# Altium schematic sheet Sheet_1 copy copy copy_2022-03-16.schdoc
size 316 x 219 mm
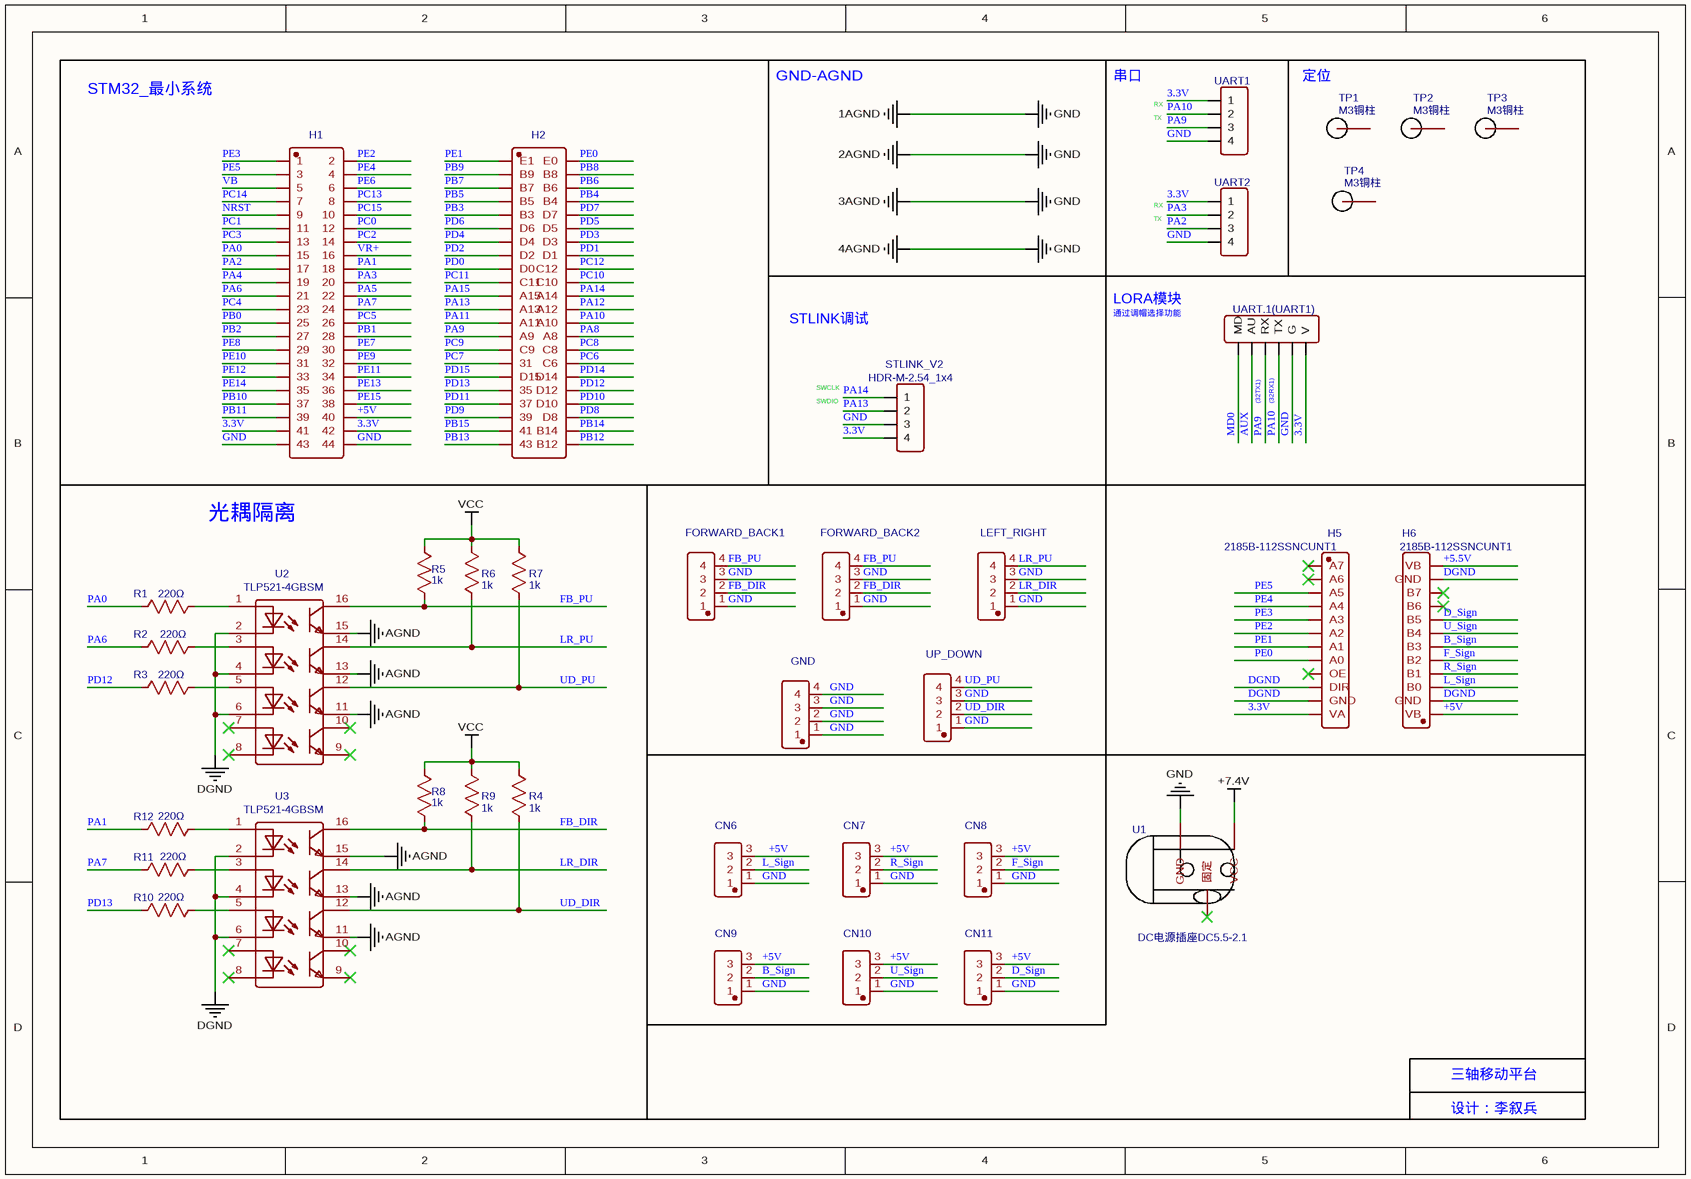
[diagram p0: Sheet_1 copy copy copy_2022-03-16.schdoc]

## Parts
CN6  15ETYRC-3.81-03P-14-00AH  [CONN-TH_15ETYRC-3.81-03P-14-00AH]  (value not drawn)
CN7  15ETYRC-3.81-03P-14-00AH  [CONN-TH_15ETYRC-3.81-03P-14-00AH]  (value not drawn)
CN8  15ETYRC-3.81-03P-14-00AH  [CONN-TH_15ETYRC-3.81-03P-14-00AH]  (value not drawn)
CN9  15ETYRC-3.81-03P-14-00AH  [CONN-TH_15ETYRC-3.81-03P-14-00AH]  (value not drawn)
CN10  15ETYRC-3.81-03P-14-00AH  [CONN-TH_15ETYRC-3.81-03P-14-00AH]  (value not drawn)
CN11  15ETYRC-3.81-03P-14-00AH  [CONN-TH_15ETYRC-3.81-03P-14-00AH]  (value not drawn)
FORWARD_BACK1  15ETYRC-3.81-04P-14-00AH  [CONN-TH_15ETYRC-3.81-04P-14-00AH]  (value not drawn)
FORWARD_BACK2  15ETYRC-3.81-04P-14-00AH  [CONN-TH_15ETYRC-3.81-04P-14-00AH]  (value not drawn)
GND  15ETYRC-3.81-04P-14-00AH  [CONN-TH_15ETYRC-3.81-04P-14-00AH]  (value not drawn)
H1  X5521FV-2X22C70D30-1000  [HDR-TH_44P-P2.54-V-F-R2-C22-S2.54]  (value not drawn)
H2  从5  [HDR-TH_44P-P2.54-V-F-R2-C22-S2.54]  (value not drawn)
H5  2185B-112SSNCUNT1  [HDR-TH_12P-P2.54-V-F]
H6  2185B-112SSNCUNT1  [HDR-TH_12P-P2.54-V-F]
LEFT_RIGHT  15ETYRC-3.81-04P-14-00AH  [CONN-TH_15ETYRC-3.81-04P-14-00AH]  (value not drawn)
R1  220Ω  [R0603]
R2  220Ω  [R0603]
R3  220Ω  [R0603]
R4  1k  [R0603]
R5  1k  [R0603]
R6  1k  [R0603]
R7  1k  [R0603]
R8  1k  [R0603]
R9  1k  [R0603]
R10  220Ω  [R0603]
R11  220Ω  [R0603]
R12  220Ω  [R0603]
STLINK_V2  HDR-M-2.54_1x4  [HDR-M-2.54_1X4]
TP1  M3铜柱  [M3铜柱]
TP2  M3铜柱  [M3铜柱]
TP3  M3铜柱  [M3铜柱]
TP4  M3铜柱  [M3铜柱]
U1  DC电源插座DC5.5-2.1  [DC电源插座5.5-2.1]
U2  TLP521-4GBSM  [OPTO-SMD-16_L20.0-W6.5-P2.54-LS10.2-BL]
U3  TLP521-4GBSM  [OPTO-SMD-16_L20.0-W6.5-P2.54-LS10.2-BL]
UART1  HDR-M-2.54_1x4  [HDR-M-2.54_1X4]  (value not drawn)
UART2  HDR-M-2.54_1x4  [HDR-M-2.54_1X4]  (value not drawn)
UART.1(UART1)  HDR-F-2.54_1x6  [HDR-F-2.54_1X6]  (value not drawn)
UP_DOWN  15ETYRC-3.81-04P-14-00AH  [CONN-TH_15ETYRC-3.81-04P-14-00AH]  (value not drawn)

## Nets
+7.4V: U1.1(VCC)
AGND: U2.11(EM) U2.13(EM) U2.15(EM) U3.11(EM) U3.13(EM) U3.15(EM)
DGND: H5.10(DIR) H5.11(GND) H6.2(GND) H6.11(GND) U2.2(CAT) U2.4(CAT) U2.6(CAT) U3.2(CAT) U3.4(CAT) U3.6(CAT)
GND: CN6.1 CN7.1 CN8.1 CN9.1 CN10.1 CN11.1 FORWARD_BACK1.1 FORWARD_BACK1.3 FORWARD_BACK2.1 FORWARD_BACK2.3 GND.1 GND.2 GND.3 GND.4 H1.43 H1.44 LEFT_RIGHT.1 LEFT_RIGHT.3 STLINK_V2.3 U1.2(GND) UART1.4 UART2.4 UART.1(UART1).5(G) UP_DOWN.1 UP_DOWN.3  [also labelled 1AGND, 2AGND, 3AGND, 4AGND]
VCC: R4.2 R5.2 R6.1 R7.2 R8.2 R9.1
3.3V: H1.41 H1.42 H5.12(VA) STLINK_V2.4 UART1.1 UART2.1 UART.1(UART1).6(V)
+5.5V: H6.12(VB)
+5V: CN6.3 CN7.3 CN8.3 CN9.3 CN10.3 CN11.3 H1.40 H6.1(VB)
AUX: UART.1(UART1).2(AU)
B_Sign: CN9.2 H6.6(B3)
D_Sign: CN11.2 H6.8(B5)
F_Sign: CN8.2 H6.5(B2)
FB_DIR: FORWARD_BACK1.2 FORWARD_BACK2.2 R8.1 U3.16(COL)
FB_PU: FORWARD_BACK1.4 FORWARD_BACK2.4 R5.1 U2.16(COL)
L_Sign: CN6.2 H6.3(B0)
LR_DIR: LEFT_RIGHT.2 R9.2 U3.14(COL)
LR_PU: LEFT_RIGHT.4 R6.2 U2.14(COL)
MD0: UART.1(UART1).1(MD)
NRST: H1.9
PA0: H1.15 R1.1
PA1: H1.18 R12.1
PA2: H1.17 UART2.3
PA3: H1.20 UART2.2
PA4: H1.19
PA5: H1.22
PA6: H1.21 R2.1
PA7: H1.24 R11.1
PA8: H2.28(A8)
PA9: H2.27(A9) UART1.3 UART.1(UART1).3(RX)
PA10: H2.26(A10) UART1.2 UART.1(UART1).4(TX)
PA11: H2.25(A11)
PA12: H2.24(A12)
PA13: H2.23(A13) STLINK_V2.2
PA14: H2.22(A14) STLINK_V2.1
PA15: H2.21(A15)
PB0: H1.25
PB1: H1.28
PB2: H1.27
PB3: H2.9(B3)
PB4: H2.8(B4)
PB5: H2.7(B5)
PB6: H2.6(B6)
PB7: H2.5(B7)
PB8: H2.4(B8)
PB9: H2.3(B9)
PB10: H1.37
PB11: H1.39
PB12: H2.44(B12)
PB13: H2.43
PB14: H2.42(B14)
PB15: H2.41
PC0: H1.12
PC1: H1.11
PC2: H1.14
PC3: H1.13
PC4: H1.23
PC5: H1.26
PC6: H2.32(C6)
PC7: H2.31
PC8: H2.30(C8)
PC9: H2.29(C9)
PC10: H2.20(C10)
PC11: H2.19(C11)
PC12: H2.18(C12)
PC13: H1.8
PC14: H1.7
PC15: H1.10
PD0: H2.17(D0)
PD1: H2.16(D1)
PD2: H2.15(D2)
PD3: H2.14(D3)
PD4: H2.13(D4)
PD5: H2.12(D5)
PD6: H2.11(D6)
PD7: H2.10(D7)
PD8: H2.40(D8)
PD9: H2.39
PD10: H2.38(D10)
PD11: H2.37
PD12: H2.36(D12) R3.1
PD13: H2.35 R10.1
PD14: H2.34(D14)
PD15: H2.33(D15)
PE0: H2.2(E0) H5.8(A0)
PE1: H2.1(E1) H5.7(A1)
PE2: H1.2 H5.6(A2)
PE3: H1.1 H5.5(A3)
PE4: H1.4 H5.4(A4)
PE5: H1.3 H5.3(A5)
PE6: H1.6
PE7: H1.30
PE8: H1.29
PE9: H1.32
PE10: H1.31
PE11: H1.34
PE12: H1.33
PE13: H1.36
PE14: H1.35
PE15: H1.38
R_Sign: CN7.2 H6.4(B1)
U_Sign: CN10.2 H6.7(B4)
UD_DIR: R4.1 U3.12(COL) UP_DOWN.2
UD_PU: R7.1 U2.12(COL) UP_DOWN.4
VB: H1.5
VR+: H1.16
NetR1_2: R1.2 U2.1(AN)
NetR2_2: R2.2 U2.3(AN)
NetR3_2: R3.2 U2.5(AN)
NetR10_2: R10.2 U3.5(AN)
NetR11_2: R11.2 U3.3(AN)
NetR12_2: R12.2 U3.1(AN)

Not connected (* = marked no-connect by the designer): H5 1(A7)* 2(A6)* 9(OE)*; H6 9(B6)* 10(B7)*; TP1 1(M3); TP2 1(M3); TP3 1(M3); TP4 1(M3); U1 3(固定)*; U2 7(AN)* 8(CAT)* 9(EM)* 10(COL)*; U3 7(AN)* 8(CAT)* 9(EM)* 10(COL)*

## Notes on the sheet
- STM32_最小系统
- GND-AGND
- 串口
- TX
- RX
- (near TP1) 定位
- STLINK调试
- LORA模块
- 通过调帽选择功能
- SWCLK
- SWDIO
- (near UART.1(UART1)) (32TX1)
- (near UART.1(UART1)) (32RX1)
- 光耦隔离
- 设计：李叙兵
- 三轴移动平台

## Library data of the parts
CN6-CN11 = 15ETYRC-3.81-03P-14-00AH: BOM_Manufacturer: Toponelec(拓宜); Contributor: LCSC; BOM_Supplier: LCSC; BOM_Supplier Part: C2828333; BOM_Manufacturer Part: 15ETYRC-3.81-03P-14-00AH; BOM_JLCPCB Part Class: Extended Part; spicePre: C; spiceSymbolName: 15ETYRC-3.81-03P-14-00AH
FORWARD_BACK1 FORWARD_BACK2 GND LEFT_RIGHT UP_DOWN = 15ETYRC-3.81-04P-14-00AH: BOM_Manufacturer: Toponelec(拓宜); Contributor: LCSC; BOM_Supplier: LCSC; BOM_Supplier Part: C2828334; BOM_Manufacturer Part: 15ETYRC-3.81-04P-14-00AH; BOM_JLCPCB Part Class: Extended Part; spicePre: C; spiceSymbolName: 15ETYRC-3.81-04P-14-00AH
H1 = X5521FV-2X22C70D30-1000: BOM_Manufacturer: XKB Connectivity; Contributor: LCSC; Package Display: No; BOM_Supplier: LCSC; BOM_Supplier Part: C2682209; BOM_Manufacturer Part: X5521FV-2x22C70D30-1000; spicePre: H; spiceSymbolName: X5521FV-2X22C70D30-1000
H2 = 从5: BOM_Manufacturer: XKB Connectivity; BOM_Manufacturer Part: X5521FV-2x22C70D30-1000; Contributor: LCSC; Package Display: No; BOM_Supplier: LCSC; BOM_Supplier Part: C2682209; spicePre: H; spiceSymbolName: X5521FV-2X22C70D30-1000
H5 H6 = 2185B-112SSNCUNT1: BOM_Manufacturer: Wcon; Contributor: LCSC; BOM_Supplier: LCSC; BOM_Supplier Part: C721800; BOM_Manufacturer Part: 2185B-112SSNCUNT1; BOM_JLCPCB Part Class: Extended Part; spicePre: H; spiceSymbolName: 2185B-112SSNCUNT1
R1-R3 R10-R12 = 220Ω: nameAlias: Value(Ω); Contributor: LCEDA_Lib; spicePre: R; spiceSymbolName: R_0603_US
R4-R9 = 1k: nameAlias: Value(Ω); Contributor: LCEDA_Lib; spicePre: R; spiceSymbolName: R_0603_US
STLINK_V2 UART1 UART2 = HDR-M-2.54_1x4: Contributor: LCEDA_Lib; BOM_Supplier Part: C124378; BOM_Supplier: LCSC; spicePre: J; spiceSymbolName: HDR-M-2.54_1x4
TP1-TP4 = M3铜柱: Contributor: xzxzhao; spicePre: T; spiceSymbolName: M3铜柱
U1 = DC电源插座DC5.5-2.1: Contributor: Ros智能车; spicePre: U; spiceSymbolName: DC电源插座DC5.5-2.1
U2 U3 = TLP521-4GBSM: BOM_Manufacturer: Isocom Components; Contributor: LCSC; BOM_Supplier: LCSC; BOM_Supplier Part: C191332; BOM_Manufacturer Part: TLP521-4GBSM; BOM_JLCPCB Part Class: Extended Part; spicePre: U; spiceSymbolName: TLP521-4GBSM
UART.1(UART1) = HDR-F-2.54_1x6: Contributor: LCEDA_Lib; BOM_Supplier Part: C40877; BOM_Supplier: LCSC; spicePre: H; spiceSymbolName: HDR-F-2.54_1x6